# Altium project F1C200S.PrjPcb
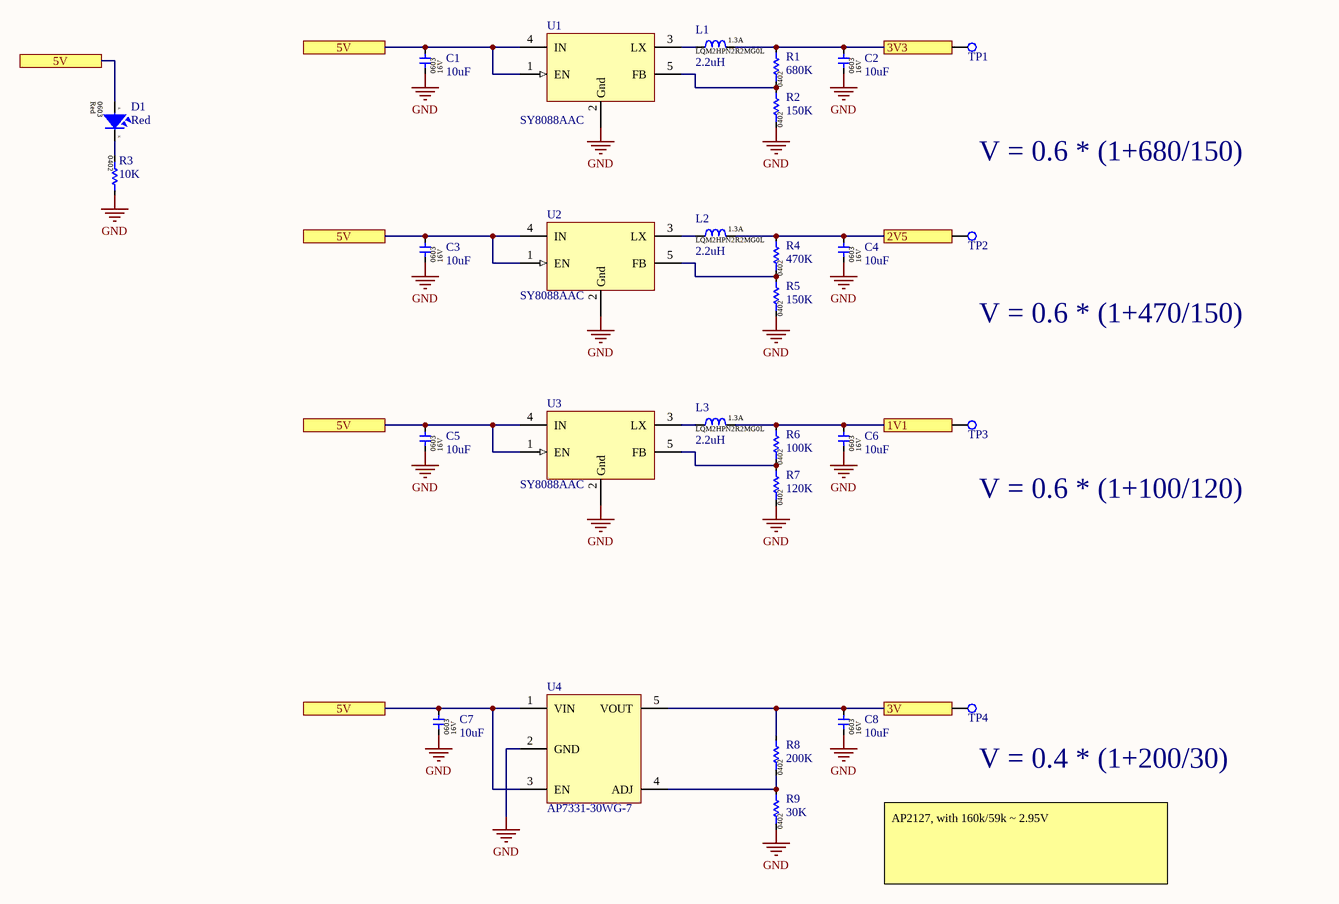
[diagram p0: POwer.SchDoc]
6 sheets, 131 parts. Net scope: flat (ports and power ports of the same name join across sheets).
Board file: PCB.PcbDoc
Sheets:
  POwer.SchDoc
  CPU.SchDoc
  LCD.SchDoc
  Memory.SchDoc
  Audio.SchDoc
  Misc.SchDoc

## Sheet POwer.SchDoc
size A3; SheetNumber: 1; SheetTotal: 6

### Parts
C1  10uF  [CAP-0603]
C2  10uF  [CAP-0603]
C3  10uF  [CAP-0603]
C4  10uF  [CAP-0603]
C5  10uF  [CAP-0603]
C6  10uF  [CAP-0603]
C7  10uF  [CAP-0603]
C8  10uF  [CAP-0603]
D1  Red  [LED-0603 RED]
L1  2.2uH  [IND-1008]
L2  2.2uH  [IND-1008]
L3  2.2uH  [IND-1008]
R1  680K  [RES-0402]
R2  150K  [RES-0402]
R3  10K  [RES-0402]
R4  470K  [RES-0402]
R5  150K  [RES-0402]
R6  100K  [RES-0402]
R7  120K  [RES-0402]
R8  200K  [RES-0402]
R9  30K  [RES-0402]
TP1  N/A  [Test point]  (value not drawn)  (no BOM)
TP2  N/A  [Test point]  (value not drawn)  (no BOM)
TP3  N/A  [Test point]  (value not drawn)  (no BOM)
TP4  N/A  [Test point]  (value not drawn)  (no BOM)
U1  SY8088AAC  [SOT23-5]
U2  SY8088AAC  [SOT23-5]
U3  SY8088AAC  [SOT23-5]
U4  AP7331-30WG-7  [SOT23-5]

### Ports
1V1, 2V5, 3V, 3V3, 5V

### Nets
AVCC: C8.2 R8.2 TP4.1 U4.5(VOUT) ; port 3V
GND: C1.1 C2.1 C3.1 C4.1 C5.1 C6.1 C7.1 C8.1 R2.1 R3.2 R5.1 R7.1 R9.1 U1.2(Gnd) U2.2(Gnd) U3.2(Gnd) U4.2(GND)
UVCC: C2.2 L1.2 R1.2 TP1.1 ; port 3V3
V-BACKLIGHT: C1.2 C3.2 C5.2 C7.2 D1.2(Anode) U1.1(EN) U1.4(IN) U2.1(EN) U2.4(IN) U3.1(EN) U3.4(IN) U4.1(VIN) U4.3(EN) ; port 5V
VCC-DRAM: C4.2 L2.2 R4.2 TP2.1 ; port 2V5
VDD-CORE: C6.2 L3.2 R6.2 TP3.1 ; port 1V1
NetD1_1: D1.1(Cathode) R3.1
NetL1_1: L1.1 U1.3(LX)
NetL2_1: L2.1 U2.3(LX)
NetL3_1: L3.1 U3.3(LX)
NetR1_1: R1.1 R2.2 U1.5(FB)
NetR4_1: R4.1 R5.2 U2.5(FB)
NetR6_1: R6.1 R7.2 U3.5(FB)
NetR8_1: R8.1 R9.2 U4.4(ADJ)

### Notes on the sheet
- V = 0.6 * (1+680/150)
- V = 0.6 * (1+470/150)
- (near TP3) V = 0.6 * (1+100/120)
- (near TP4) V = 0.4 * (1+200/30)
- AP2127, with 160k/59k ~ 2.95V
- (in symbol 19-217/R6C-AL1M2VY/3T) A; K

### Library data of the parts
C1-C8 = 0603X106M160CT: 16V 10uF X5R ±20% 0603 Multilayer Ceramic Capacitors MLCC - SMD/SMT ROHS; Manufacture: WALSIN; Package / Case: 0402; Component type: Capacitor; Manufacture part: 0603X106M160CT; Capacitor value: 10uF; Voltage: 16V; Package: 0603
D1 = 19-217/R6C-AL1M2VY/3T: Red 617.5~633.5nm 0603 Light Emitting Diodes (LED) RoHS; Manufacture: Everlight Elec; Package / Case: 0402; Component type: Led; Part reference: *; Manufacture part: 19-217/R6C-AL1M2VY/3T; Color: Red; Package: 0603
L1-L3 = LQM2HPN2R2MG0L: Inductor 1008, 2.2±20%, 1.3A; Manufacture: Murata Electronics; DCR: 0.1 Ω; Manufacture part: LQM2HPN2R2MG0L; Inductance value: 2.2uH; Irms max: 1.3A; Package: 1008
R1 = WR04X6803FTL: ±1% 1/16W 50V ±100ppm/℃ -55℃~+155℃ 680kΩ 0402 Chip Resistor - Surface Mount ROHS; Manufacture: WALSIN; Package / Case: 0201; Component type: Resistor; Manufacture part: WR04X6803FTL; Resistor value: 680K; Package: 0402
R2 R5 = WR04X1503FTL: 150kΩ ±1% 1/16W ±100ppm/℃ 0402 Chip Resistor - Surface Mount RoHS; Manufacture: WALSIN; Package / Case: 0201; Component type: Resistor; Manufacture part: WR04X1503FTL; Resistor value: 150K; Package: 0402
R3 = WR04X1002FTL: 10kΩ ±1% 1/16W ±100ppm/℃ 0402 Chip Resistor - Surface Mount RoHS; Manufacture: WALSIN; Package / Case: 0201; Component type: Resistor; Manufacture part: WR04X1002FTL; Resistor value: 10K; Package: 0402
R4 = WR04X4703FTL: ±1% 1/16W 50V ±100ppm/℃ -55℃~+155℃ 470kΩ 0402 Chip Resistor - Surface Mount ROHS; Manufacture: WALSIN; Package / Case: 0201; Component type: Resistor; Manufacture part: WR04X4703FTL; Resistor value: 470K; Package: 0402
R6 = WR04X1003FTL: 100kΩ ±1% 1/16W ±100ppm/℃ 0402 Chip Resistor - Surface Mount RoHS; Manufacture: WALSIN; Package / Case: 0201; Component type: Resistor; Manufacture part: WR04X1003FTL; Resistor value: 100K; Package: 0402
R7 = WR04X1203FTL: 120kΩ ±1% 1/16W ±100ppm/℃ 0402 Chip Resistor - Surface Mount RoHS; Manufacture: WALSIN; Package / Case: 0201; Component type: Resistor; Manufacture part: WR04X1203FTL; Resistor value: 120K; Package: 0402
R8 = WR04X2003FTL: 200kΩ ±1% 1/16W ±100ppm/℃ 0402 Chip Resistor - Surface Mount RoHS; Manufacture: WALSIN; Package / Case: 0201; Component type: Resistor; Manufacture part: WR04X2003FTL; Resistor value: 200K; Package: 0402
R9 = WR04X3002FTL: ±1% 1/16W ±100ppm/℃ 30kΩ 0402 Chip Resistor - Surface Mount ROHS; Manufacture: WALSIN; Package / Case: 0201; Component type: Resistor; Manufacture part: WR04X3002FTL; Resistor value: 30K; Package: 0402
TP1-TP4 = N/A: A point used for measure.; Manufacture part: N/A; Manufacture: N/A; Type: Test point
U1-U3 = SY8088AAC: 5.5V 1A SOT-23-5 DC-DC Converters RoHS; Manufacture: Richtek Tech; Manufacture part: SY8088AAC; Type: Buck; Package: SOT23-5; Datasheet: https://datasheet.lcsc.com/lcsc/Silergy-Corp-SY8088AAC_C79313.pdf
U4 = AP7331-30WG-7: Fixed 6V 3V 550mV @ 300mA SOT-25 Dropout Regulators(LDO) RoHS; Manufacture: Diodes Incorporated; Part number: AP7331-WG-7; Manufacture part: AP7331-30WG-7; Type: LDO; Package: SOT23-5; Datasheet: https://datasheet.lcsc.com/lcsc/Diodes-Incorporated-AP7331-WG-7_C212322.pdf

## Sheet CPU.SchDoc
size A3; SheetNumber: 3; SheetTotal: 7
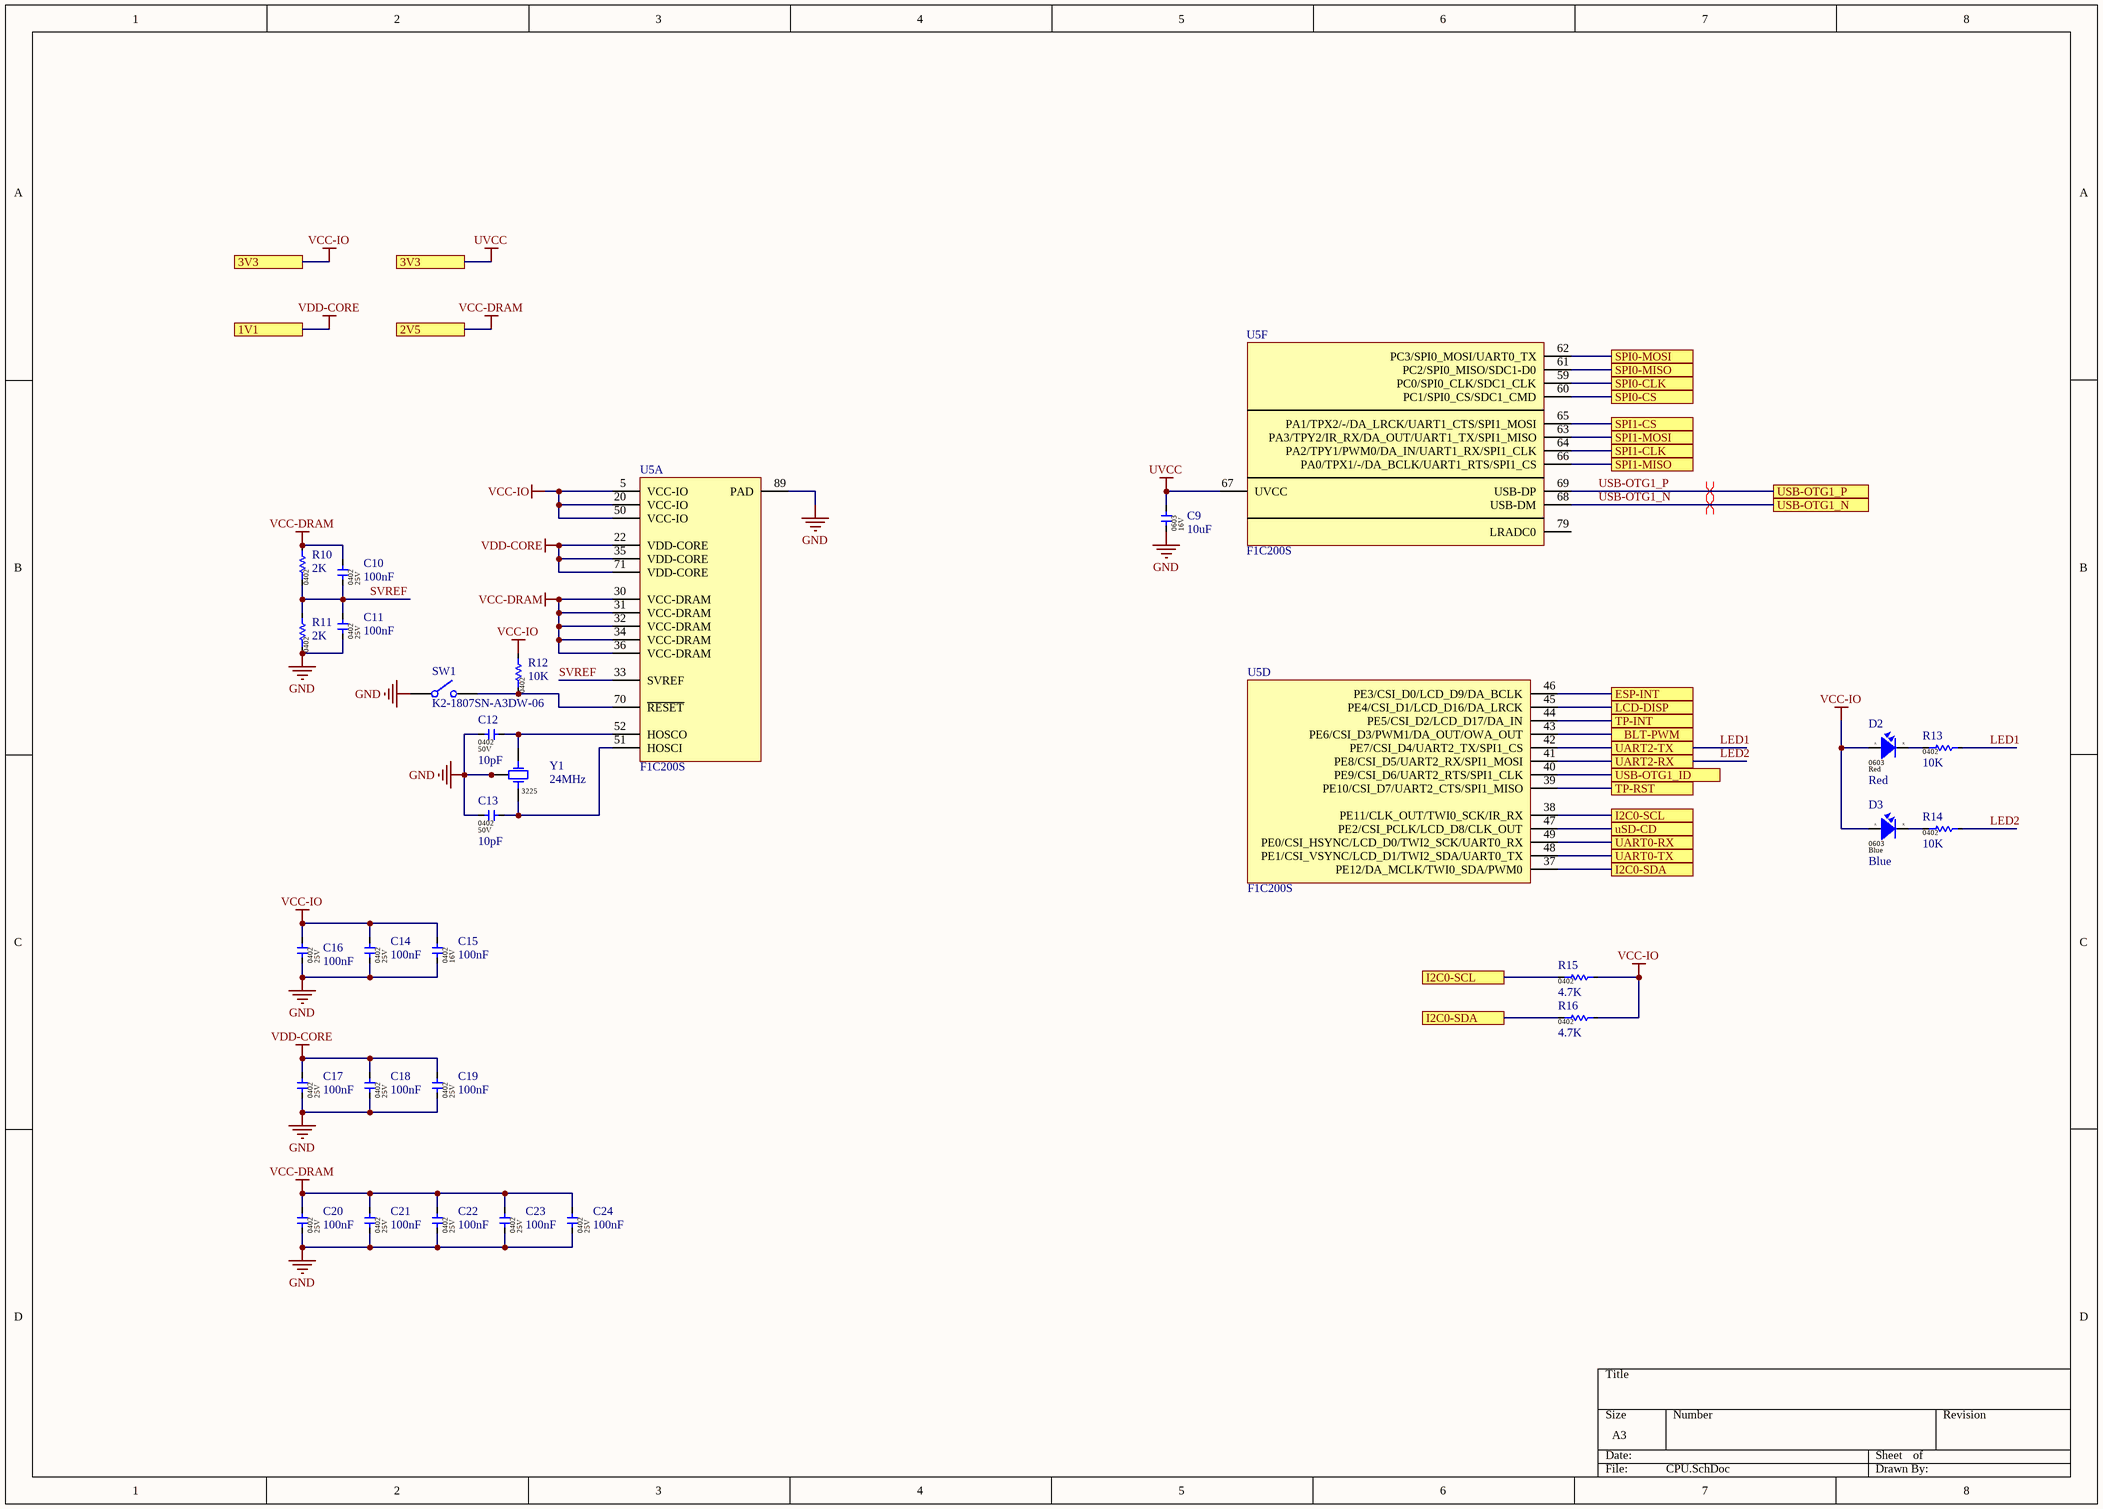
[diagram p1: CPU.SchDoc]

### Parts
C9  10uF  [CAP-0603]
C10  100nF  [CAP-0402]
C11  100nF  [CAP-0402]
C12  10pF  [CAP-0402]
C13  10pF  [CAP-0402]
C14  100nF  [CAP-0402]
C15  100nF  [CAP-0402]
C16  100nF  [CAP-0402]
C17  100nF  [CAP-0402]
C18  100nF  [CAP-0402]
C19  100nF  [CAP-0402]
C20  100nF  [CAP-0402]
C21  100nF  [CAP-0402]
C22  100nF  [CAP-0402]
C23  100nF  [CAP-0402]
C24  100nF  [CAP-0402]
D2  Red  [LED-0603 RED]
D3  Blue  [LED-0603 BLUE]
R10  2K  [RES-0402]
R11  2K  [RES-0402]
R12  10K  [RES-0402]
R13  10K  [RES-0402]
R14  10K  [RES-0402]
R15  4.7K  [RES-0402]
R16  4.7K  [RES-0402]
SW1  K2-1807SN-A3DW-06  [SW - TYPE 3]
U5  F1C200S  [F1Cx00s]  (parts A,D,F of 6)
Y1  24MHz  [Crystal-3225]

### Ports
1V1, 2V5, 3V3, BLT-PWM, ESP-INT, I2C0-SCL, I2C0-SDA, LCD-DISP, SPI0-CLK, SPI0-CS, SPI0-MISO, SPI0-MOSI, SPI1-CLK, SPI1-CS, SPI1-MISO, SPI1-MOSI, TP-INT, TP-RST, UART0-RX, UART0-TX, UART2-RX, UART2-TX, USB-OTG1_ID, USB-OTG1_N, USB-OTG1_P, uSD-CD

### Nets
GND: C9.1 C11.1 C12.1 C13.1 C14.1 C15.1 C16.1 C17.1 C18.1 C19.1 C20.1 C21.1 C22.1 C23.1 C24.1 R11.1 SW1.1 U5.89(PAD) Y1.2(GND) Y1.4(GND)
UVCC: C9.2 C14.2 C15.2 C16.2 D2.2(Anode) D3.2(Anode) R12.2 R15.2 R16.2 U5.5(VCC-IO) U5.20(VCC-IO) U5.50(VCC-IO) U5.67(UVCC) ; port 3V3  [also labelled VCC-IO]
VCC-DRAM: C10.2 C20.2 C21.2 C22.2 C23.2 C24.2 R10.2 U5.30(VCC-DRAM) U5.31(VCC-DRAM) U5.32(VCC-DRAM) U5.34(VCC-DRAM) U5.36(VCC-DRAM) ; port 2V5
VDD-CORE: C17.2 C18.2 C19.2 U5.22(VDD-CORE) U5.35(VDD-CORE) U5.71(VDD-CORE) ; port 1V1
LED1: R13.2 U5.42(PE7/CSI_D4/UART2_TX/SPI1_CS) ; port UART2-TX
LED2: R14.2 U5.41(PE8/CSI_D5/UART2_RX/SPI1_MOSI) ; port UART2-RX
SS-SCL: R15.1 U5.38(PE11/CLK_OUT/TWI0_SCK/IR_RX) ; port I2C0-SCL
SS-SDA: R16.1 U5.37(PE12/DA_MCLK/TWI0_SDA/PWM0) ; port I2C0-SDA
SVREF: C10.1 C11.2 R10.1 R11.2 U5.33(SVREF)
USB-OTG1_N: U5.68(USB-DM) ; port USB-OTG1_N
USB-OTG1_P: U5.69(USB-DP) ; port USB-OTG1_P
NetC12_2: C12.2 U5.52(HOSCO) Y1.1(X1)
NetC13_2: C13.2 U5.51(HOSCI) Y1.3(X2)
NetD2_1: D2.1(Cathode) R13.1
NetD3_1: D3.1(Cathode) R14.1
NetD5_2: U5.43(PE6/CSI_D3/PWM1/DA_OUT/OWA_OUT) ; port BLT-PWM
NetD6_5: U5.40(PE9/CSI_D6/UART2_RTS/SPI1_CLK) ; port USB-OTG1_ID
NetJ1_1: U5.39(PE10/CSI_D7/UART2_CTS/SPI1_MISO) ; port TP-RST
NetJ1_4: U5.44(PE5/CSI_D2/LCD_D17/DA_IN) ; port TP-INT
NetJ2_31: U5.45(PE4/CSI_D1/LCD_D16/DA_LRCK) ; port LCD-DISP
NetJ6_1: U5.48(PE1/CSI_VSYNC/LCD_D1/TWI2_SDA/UART0_TX) ; port UART0-TX
NetJ6_2: U5.49(PE0/CSI_HSYNC/LCD_D0/TWI2_SCK/UART0_RX) ; port UART0-RX
NetR12_1: R12.1 SW1.2 U5.70(~{RESET})
NetR24_1: U5.47(PE2/CSI_PCLK/LCD_D8/CLK_OUT) ; port uSD-CD
NetR27_2: U5.60(PC1/SPI0_CS/SDC1_CMD) ; port SPI0-CS
NetR30_1: U5.65(PA1/TPX2/-/DA_LRCK/UART1_CTS/SPI1_MOSI) ; port SPI1-CS
NetSW2_2: U5.59(PC0/SPI0_CLK/SDC1_CLK) ; port SPI0-CLK
NetU5_46: U5.46(PE3/CSI_D0/LCD_D9/DA_BCLK) ; port ESP-INT
NetU5_61: U5.61(PC2/SPI0_MISO/SDC1-D0) ; port SPI0-MISO
NetU5_62: U5.62(PC3/SPI0_MOSI/UART0_TX) ; port SPI0-MOSI
NetU5_63: U5.63(PA3/TPY2/IR_RX/DA_OUT/UART1_TX/SPI1_MISO) ; port SPI1-MOSI
NetU5_64: U5.64(PA2/TPY1/PWM0/DA_IN/UART1_RX/SPI1_CLK) ; port SPI1-CLK
NetU5_66: U5.66(PA0/TPX1/-/DA_BCLK/UART1_RTS/SPI1_CS) ; port SPI1-MISO

Not connected (* = marked no-connect by the designer): U5 79(LRADC0)

### Layout directives
differential pair; differential pair class DIFF90_USB: USB-OTG1_N, USB-OTG1_P

### Notes on the sheet
- (in symbol 19-217/BHC-ZL1M2RY/3T) A; K
- (in symbol 19-217/R6C-AL1M2VY/3T) A; K

### Library data of the parts
C9 = 0603X106M160CT: as C1 on sheet POwer; Package / Case: 0402; Component type: Capacitor; Manufacture part: 0603X106M160CT; Capacitor value: 10uF; Voltage: 16V; Package: 0603
C10 C11 C14 C16-C24 = 0402X104K250CT: 100nF ±10% 25V X5R 0402 Multilayer Ceramic Capacitors MLCC - SMD/SMT RoHS; Manufacture: WALSIN; Package / Case: 0402; Component type: Capacitor; Manufacture part: 0402X104K250CT; Capacitor value: 100nF; Voltage: 25V; Package: 0402
C12 C13 = 0402N100J500CT: 10pF ±5% 50V NP0 0402 Multilayer Ceramic Capacitors MLCC - SMD/SMT RoHS; Manufacture: WALSIN; Package / Case: 0402; Component type: Capacitor; Manufacture part: 0402N100J500CT; Capacitor value: 10pF; Voltage: 50V; Package: 0402
C15 = 0402B104K160CT: 100nF ±10% 16V X7R 0402 Multilayer Ceramic Capacitors MLCC - SMD/SMT RoHS; Manufacture: WALSIN; Package / Case: 0402; Component type: Capacitor; Manufacture part: 0402B104K160CT; Capacitor value: 100nF; Voltage: 16V; Package: 0402
D2 = 19-217/R6C-AL1M2VY/3T: as D1 on sheet POwer; Package / Case: 0402; Component type: Led; Part reference: *; Manufacture part: 19-217/R6C-AL1M2VY/3T; Color: Red; Package: 0603
D3 = 19-217/BHC-ZL1M2RY/3T: Blue 465~475nm 0603 Light Emitting Diodes (LED) RoHS; Manufacture: Everlight Elec; Package / Case: 0402; Component type: Led; Part reference: *; Manufacture part: 19-217/BHC-ZL1M2RY/3T; Color: Blue; Package: 0603
R10 R11 = WR04X2001FTL: 2kΩ ±1% 1/16W ±100ppm/℃ 0402 Chip Resistor - Surface Mount RoHS; Manufacture: WALSIN; Package / Case: 0201; Component type: Resistor; Manufacture part: WR04X2001FTL; Resistor value: 2K; Package: 0402
R12-R14 = WR04X1002FTL: as R3 on sheet POwer; Package / Case: 0201; Component type: Resistor; Manufacture part: WR04X1002FTL; Resistor value: 10K; Package: 0402
R15 R16 = WR04X4701FTL: 4.7kΩ ±1% 1/16W ±100ppm/℃ 0402 Chip Resistor - Surface Mount RoHS; Manufacture: WALSIN; Package / Case: 0201; Component type: Resistor; Manufacture part: WR04X4701FTL; Resistor value: 4.7K; Package: 0402
SW1 = K2-1807SN-A3DW-06: SMD,3×4×2.0mm Tactile Switches RoHS; Manufacture: Korean Hroparts Elec; Manufacture part: K2-1807SN-A3DW-06; Type: Tactile Switches; Datasheet: https://datasheet.lcsc.com/lcsc/2008221234_XUNPU-TS-1088-AR02016_C720477.pdf
U5 = F1C200S: The Allwinner F1C200s is a small SoC with an ARM926EJ-S CPU core and 64MB of embedded DDR SDRAM.; Manufacture part: F1C200S; Manufacture: Allwinner; Package: QFN-88 (10x10); Datasheet: https://linux-sunxi.org/images/1/11/Allwinner_F1C200s_Datasheet_V1.0.pdf
Y1 = SX32Y024000BC1T: 24MHz ±10ppm 12pF 40Ω SMD-3225 Crystals RoHS; Manufacture: TKD; Manufacture part: SX32Y024000BC1T; Crystal value: 24MHz; Package: 3225

## Sheet LCD.SchDoc
size A3; SheetNumber: 4; SheetTotal: 7
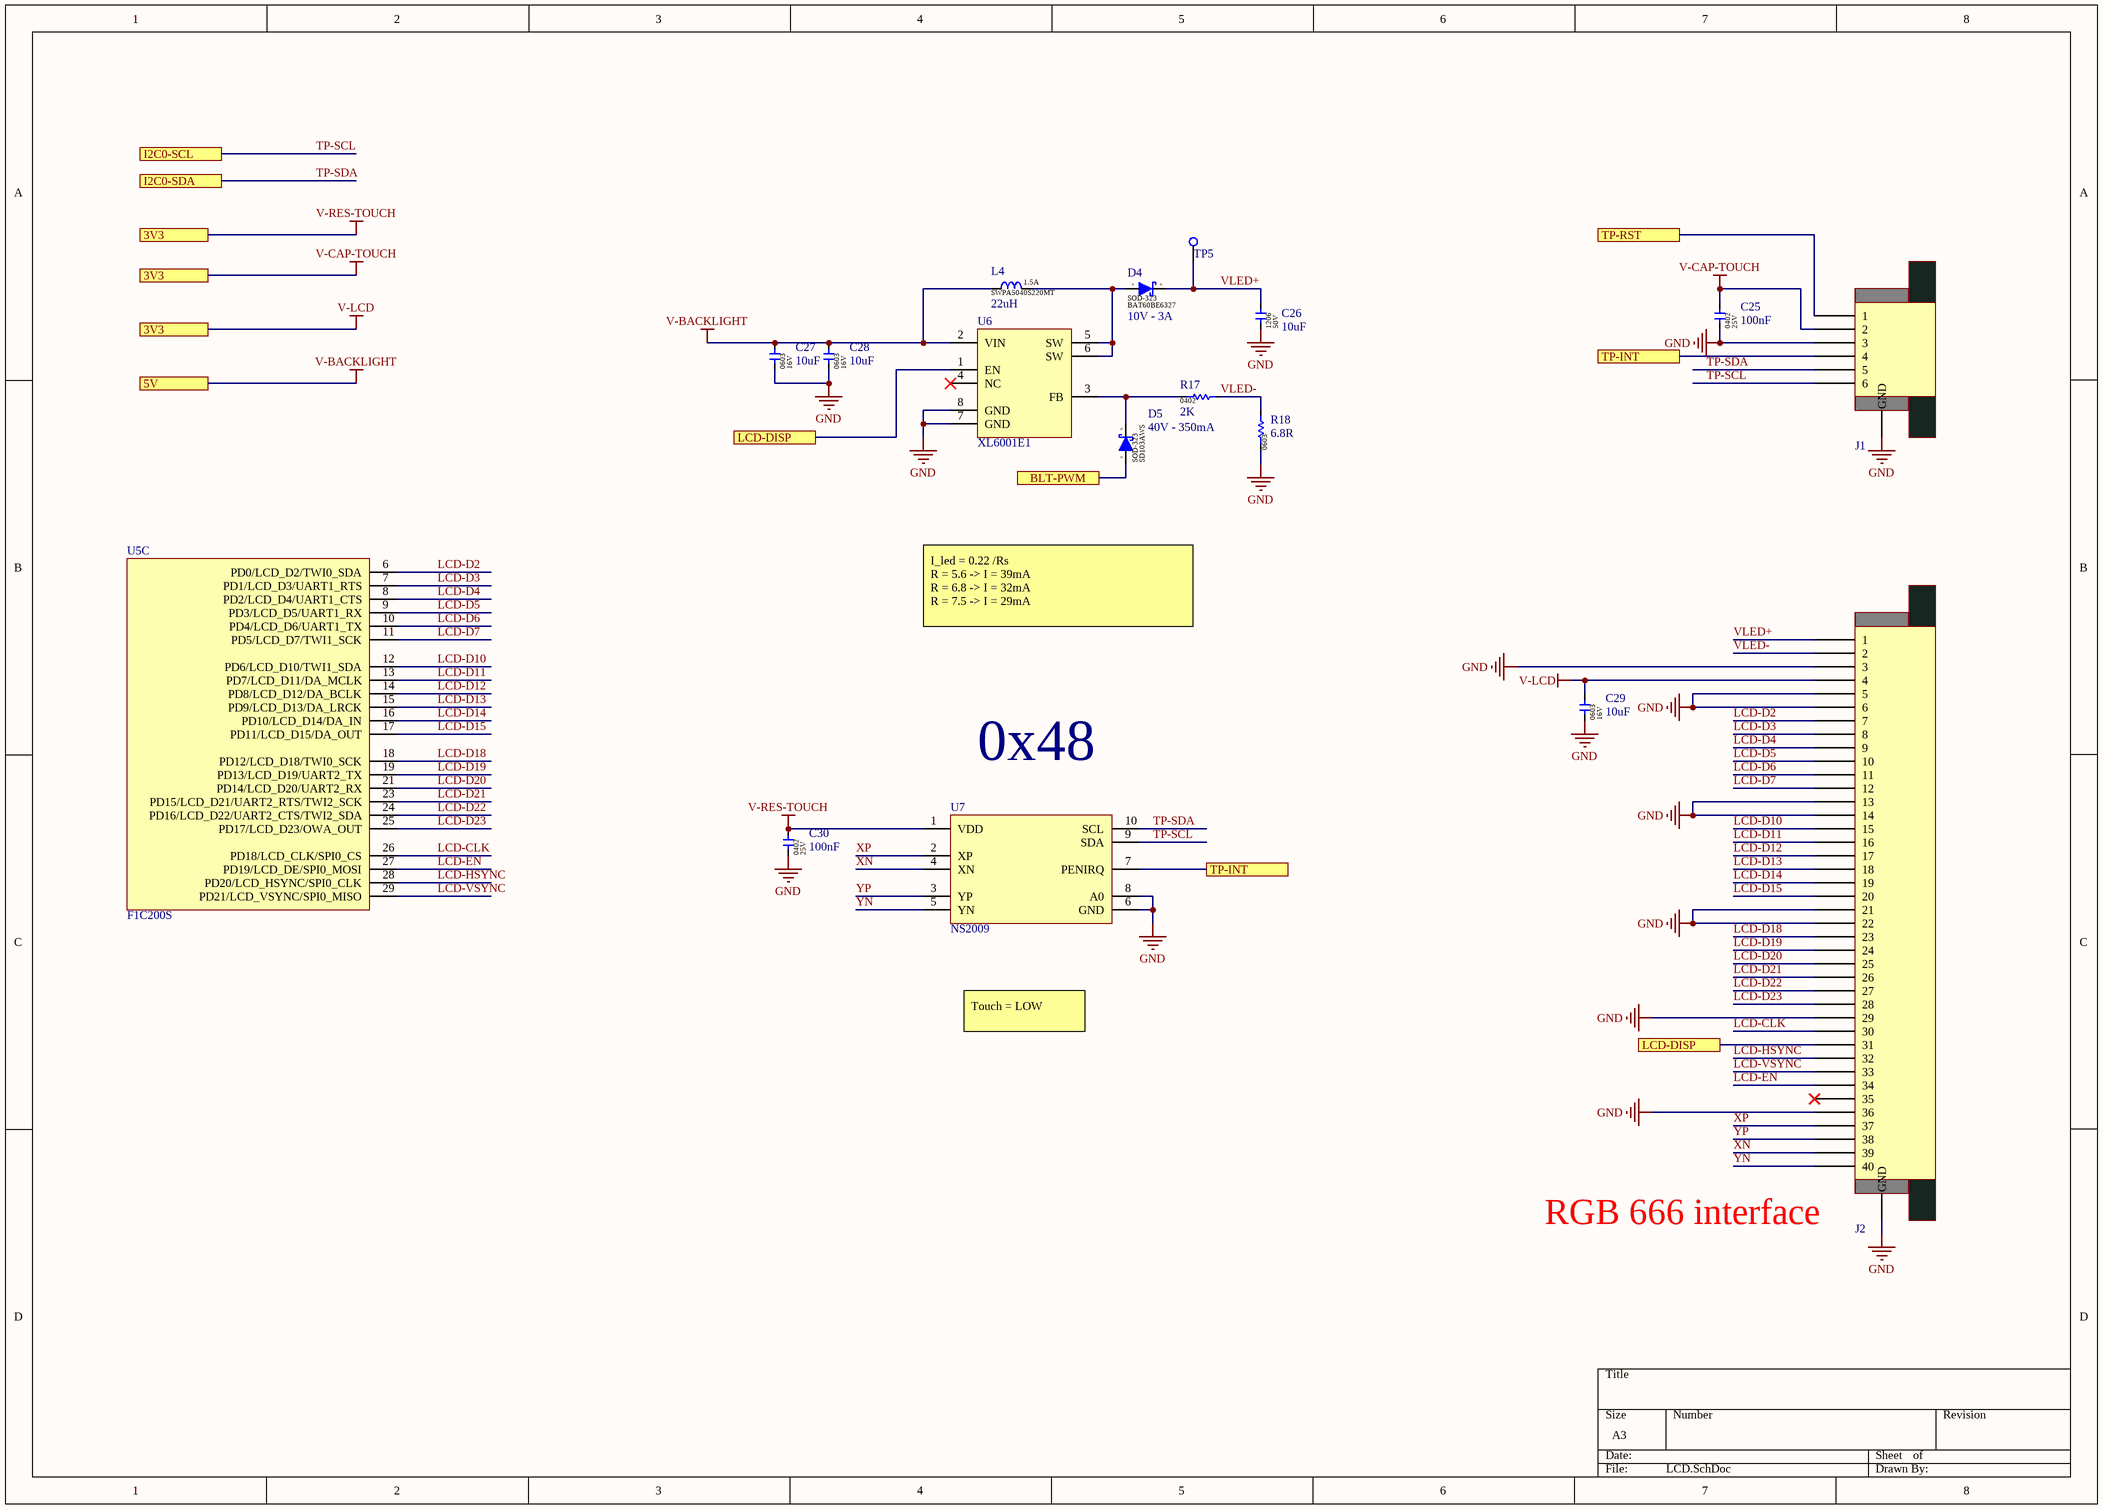
[diagram p2: LCD.SchDoc]

### Parts
C25  100nF  [CAP-0402]
C26  10uF  [CAP-1206]
C27  10uF  [CAP-0603]
C28  10uF  [CAP-0603]
C29  10uF  [CAP-0603]
C30  100nF  [CAP-0402]
D4  10V - 3A  [SOD323 (UNI)]
D5  40V - 350mA  [SOD323 (UNI)]
J1  AFC07-S06ECC-00  [FPC - 6P, 0.5mm, top]  (value not drawn)
J2  AFC07-S40ECC-00  [FPC - 40P, 0.5mm, top]  (value not drawn)
L4  22uH  [IND-5040]
R17  2K  [RES-0402]
R18  6.8R  [RES-0603]
TP5  N/A  [Test point]  (value not drawn)  (no BOM)
U5  F1C200S  [F1Cx00s]  (part C of 6)
U6  XL6001E1  [SOP-8]
U7  NS2009  [MSOP-10]

### Ports
3V3, 5V, BLT-PWM, I2C0-SCL, I2C0-SDA, LCD-DISP, TP-INT, TP-RST

### Nets
GND: C25.1 C26.1 C27.1 C28.1 C29.1 C30.1 J1.0(GND) J1.3 J2.0(GND) J2.3 J2.5 J2.6 J2.13 J2.14 J2.21 J2.22 J2.29 J2.36 R18.1 U6.7(GND) U6.8(GND) U7.6(GND) U7.8(A0)
V-BACKLIGHT: C27.2 C28.2 L4.1 U6.2(VIN) ; port 5V
V-CAP-TOUCH: C25.2 C29.2 C30.2 J1.2 J2.4 U7.1(VDD) ; port 3V3  [also labelled V-LCD, V-RES-TOUCH]  [project net UVCC]
LCD-CLK: J2.30 U5.26(PD18/LCD_CLK/SPI0_CS)
LCD-D2: J2.7 U5.6(PD0/LCD_D2/TWI0_SDA)
LCD-D3: J2.8 U5.7(PD1/LCD_D3/UART1_RTS)
LCD-D4: J2.9 U5.8(PD2/LCD_D4/UART1_CTS)
LCD-D5: J2.10 U5.9(PD3/LCD_D5/UART1_RX)
LCD-D6: J2.11 U5.10(PD4/LCD_D6/UART1_TX)
LCD-D7: J2.12 U5.11(PD5/LCD_D7/TWI1_SCK)
LCD-D10: J2.15 U5.12(PD6/LCD_D10/TWI1_SDA)
LCD-D11: J2.16 U5.13(PD7/LCD_D11/DA_MCLK)
LCD-D12: J2.17 U5.14(PD8/LCD_D12/DA_BCLK)
LCD-D13: J2.18 U5.15(PD9/LCD_D13/DA_LRCK)
LCD-D14: J2.19 U5.16(PD10/LCD_D14/DA_IN)
LCD-D15: J2.20 U5.17(PD11/LCD_D15/DA_OUT)
LCD-D18: J2.23 U5.18(PD12/LCD_D18/TWI0_SCK)
LCD-D19: J2.24 U5.19(PD13/LCD_D19/UART2_TX)
LCD-D20: J2.25 U5.21(PD14/LCD_D20/UART2_RX)
LCD-D21: J2.26 U5.23(PD15/LCD_D21/UART2_RTS/TWI2_SCK)
LCD-D22: J2.27 U5.24(PD16/LCD_D22/UART2_CTS/TWI2_SDA)
LCD-D23: J2.28 U5.25(PD17/LCD_D23/OWA_OUT)
LCD-EN: J2.34 U5.27(PD19/LCD_DE/SPI0_MOSI)
LCD-HSYNC: J2.32 U5.28(PD20/LCD_HSYNC/SPI0_CLK)
LCD-VSYNC: J2.33 U5.29(PD21/LCD_VSYNC/SPI0_MISO)
TP-SCL: J1.6 U7.9(SDA) ; port I2C0-SCL  [project net SS-SCL]
TP-SDA: J1.5 U7.10(SCL) ; port I2C0-SDA  [project net SS-SDA]
VLED+: C26.2 D4.1(Cathode) J2.1 TP5.1
VLED-: J2.2 R17.2 R18.2
XN: J2.39 U7.4(XN)
XP: J2.37 U7.2(XP)
YN: J2.40 U7.5(YN)
YP: J2.38 U7.3(YP)
NetD4_2: D4.2(Anode) L4.2 U6.5(SW) U6.6(SW)
NetD5_1: D5.1(Cathode) R17.1 U6.3(FB)
NetD5_2: D5.2(Anode) ; port BLT-PWM
NetJ1_1: J1.1 ; port TP-RST
NetJ1_4: J1.4 U7.7(PENIRQ) ; port TP-INT
NetJ2_31: J2.31 U6.1(EN) ; port LCD-DISP

Not connected (* = marked no-connect by the designer): J2 35*; U6 4(NC)*

### Notes on the sheet
- I_led = 0.22 /Rs
  R = 5.6 -> I = 39mA
  R = 6.8 -> I = 32mA
  R = 7.5 -> I = 29mA
- 0x48
- Touch = LOW
- (near J2) RGB 666 interface
- (in symbol BAT60BE6327) A; K
- (in symbol SD103AWS) K; A

### Library data of the parts
C25 C30 = 0402X104K250CT: as C10 on sheet CPU; Package / Case: 0402; Component type: Capacitor; Manufacture part: 0402X104K250CT; Capacitor value: 100nF; Voltage: 25V; Package: 0402
C26 = 1206X106K500CT: 10uF ±10% 50V X5R 1206 Multilayer Ceramic Capacitors MLCC - SMD/SMT RoHS; Manufacture: WALSIN; Package / Case: 0402; Component type: Capacitor; Manufacture part: 1206X106K500CT; Capacitor value: 10uF; Voltage: 50V; Package: 1206
C27-C29 = 0603X106M160CT: as C1 on sheet POwer; Package / Case: 0402; Component type: Capacitor; Manufacture part: 0603X106M160CT; Capacitor value: 10uF; Voltage: 16V; Package: 0603
D4 = BAT60BE6327: 10V 3A 600mV @ 1A SOD-323 Schottky Barrier Diodes (SBD) RoHS; Manufacture: Infineon Technologies; Manufacture part: BAT60BE6327; Type: Schottky diode; Diode value: 10V - 3A; Package: SOD-323; Datasheet: https://datasheet.lcsc.com/lcsc/1809021231_Infineon-Technologies-BAT60BE6327_C91059.pdf
D5 = SD103AWS: 40V 350mA 600mV @ 200mA SOD-323 Schottky Barrier Diodes (SBD) ROHS; Manufacture: Shikues; Manufacture part: SD103AWS; Type: Schottky diode; Diode value: 40V - 350mA; Package: SOD-323; Datasheet: https://datasheet.lcsc.com/lcsc/1809211226_Shikues-SD103AWS_C109204.pdf
J1 = AFC07-S06ECC-00: Slide Lock Contact,Top 6P FFC/FPC Connectors ROHS; Manufacture: JUSHUO; Manufacture part: AFC07-S06ECC-00; Type: FPC; Datasheet: https://datasheet.lcsc.com/lcsc/1811021327_JUSHUO-AFC07-S06ECC-00_C11083.pdf
J2 = AFC07-S40ECC-00: Contact,Top 40 0.020"（0.50mm） 0.079"（2.00mm） Slide Lock 40P FFC, FPC Connectors RoHS; Manufacture: JUSHUO; Manufacture part: AFC07-S40ECC-00; Type: FPC; Datasheet: https://datasheet.lcsc.com/lcsc/JUSHUO-AFC07-S40ECC-00_C11097.pdf
L4 = SWPA5040S220MT: Inductor 22uH ±20% 1.5A, 5.0x5.0x4; Manufacture: SUNLORD; DCR: 0.168 Ω; Manufacture part: SWPA5040S220MT; Inductance value: 22uH; Irms max: 1.5A; Package: 5040
R17 = WR04X2001FTL: as R10 on sheet CPU; Package / Case: 0201; Component type: Resistor; Manufacture part: WR04X2001FTL; Resistor value: 2K; Package: 0402
R18 = WR06W6R80FTL: 6.8Ω ±1% ±1% 0.1W -200ppm/℃~+400ppm/℃ 0603 Chip Resistor - Surface Mount RoHS; Manufacture: WALSIN; Package / Case: 0201; Component type: Resistor; Manufacture part: WR06W6R80FTL; Resistor value: 6.8R; Package: 0603
TP5 = N/A: A point used for measure.; Manufacture part: N/A; Manufacture: N/A; Type: Test point
U5 = F1C200S: as U5 on sheet CPU; Manufacture part: F1C200S; Manufacture: Allwinner; Package: QFN-88 (10x10); Datasheet: https://linux-sunxi.org/images/1/11/Allwinner_F1C200s_Datasheet_V1.0.pdf
U6 = XL6001E1: SOIC-8_150mil LED Drivers RoHS; Manufacture: XLSEMI; Manufacture part: XL6001E1; Package: SOP-8; Datasheet: https://datasheet.lcsc.com/lcsc/1809191820_XLSEMI-XL6001E1_C73343.pdf
U7 = NS2009: MSOP-10 Touch Screen Controllers RoHS; Manufacture: Shenzhen Nsiway Tech; Manufacture part: NS2009; Package: MSOP-10; Datasheet: https://datasheet.lcsc.com/lcsc/1810181630_Shenzhen-Nsiway-Tech-NS2009_C219024.pdf

## Sheet Memory.SchDoc
size A3; SheetNumber: 5; SheetTotal: 7
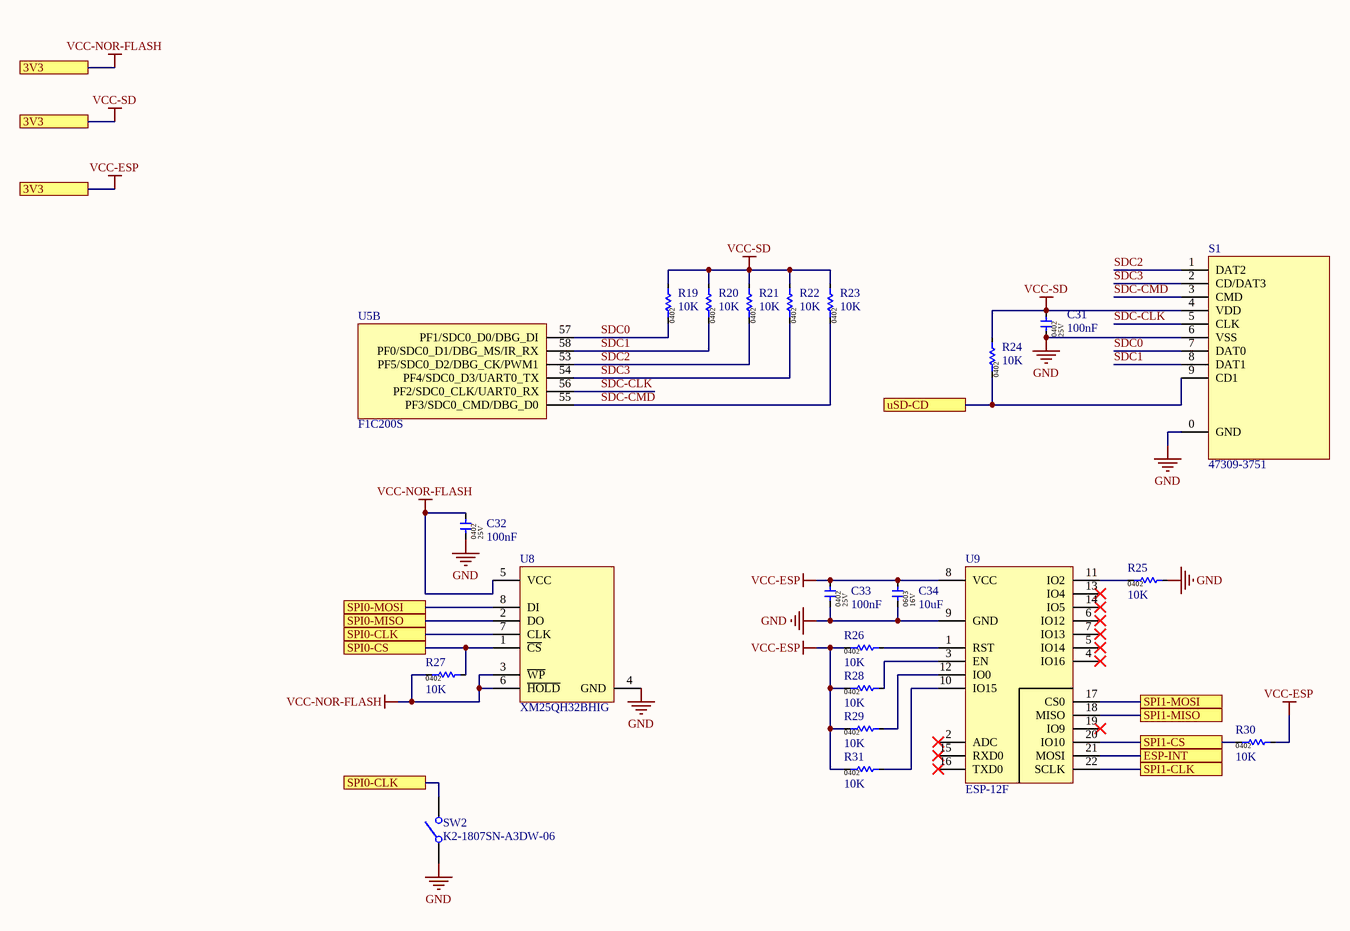
[diagram p3: Memory.SchDoc]

### Parts
C31  100nF  [CAP-0402]
C32  100nF  [CAP-0402]
C33  100nF  [CAP-0402]
C34  10uF  [CAP-0603]
R19  10K  [RES-0402]
R20  10K  [RES-0402]
R21  10K  [RES-0402]
R22  10K  [RES-0402]
R23  10K  [RES-0402]
R24  10K  [RES-0402]
R25  10K  [RES-0402]
R26  10K  [RES-0402]
R27  10K  [RES-0402]
R28  10K  [RES-0402]
R29  10K  [RES-0402]
R30  10K  [RES-0402]
R31  10K  [RES-0402]
S1  47309-3751  [Micro SDCARD short]
SW2  K2-1807SN-A3DW-06  [SW - TYPE 3]
U5  F1C200S  [F1Cx00s]  (part B of 6)
U8  XM25QH32BHIG  [SOP8-208mil]
U9  ESP-12F  [ESP8266]

### Ports
3V3, ESP-INT, SPI0-CLK, SPI0-CS, SPI0-MISO, SPI0-MOSI, SPI1-CLK, SPI1-CS, SPI1-MISO, SPI1-MOSI, uSD-CD

### Nets
GND: C31.1 C32.1 C33.1 C34.1 R25.2 S1.0(GND) S1.6(VSS) SW2.1 U8.4(GND) U9.9(GND)
VCC-ESP: C31.2 C32.2 C33.2 C34.2 R19.2 R20.2 R21.2 R22.2 R23.2 R24.2 R26.1 R27.1 R28.1 R29.1 R30.2 R31.1 S1.4(VDD) U8.3(~{WP}) U8.5(VCC) U8.6(~{HOLD}) U9.8(VCC) ; port 3V3  [also labelled VCC-NOR-FLASH, VCC-SD]  [project net UVCC]
SDC0: R19.1 S1.7(DAT0) U5.57(PF1/SDC0_D0/DBG_DI)
SDC1: R20.1 S1.8(DAT1) U5.58(PF0/SDC0_D1/DBG_MS/IR_RX)
SDC2: R21.1 S1.1(DAT2) U5.53(PF5/SDC0_D2/DBG_CK/PWM1)
SDC3: R22.1 S1.2(CD/DAT3) U5.54(PF4/SDC0_D3/UART0_TX)
SDC-CLK: S1.5(CLK) U5.56(PF2/SDC0_CLK/UART0_RX)
SDC-CMD: R23.1 S1.3(CMD) U5.55(PF3/SDC0_CMD/DBG_D0)
NetR24_1: R24.1 S1.9(CD1) ; port uSD-CD
NetR25_1: R25.1 U9.11(IO2)
NetR26_2: R26.2 U9.1(RST)
NetR27_2: R27.2 U8.1(~{CS}) ; port SPI0-CS
NetR28_2: R28.2 U9.3(EN)
NetR29_2: R29.2 U9.12(IO0)
NetR30_1: R30.1 U9.20(IO10) ; port SPI1-CS
NetR31_2: R31.2 U9.10(IO15)
NetSW2_2: SW2.2 U8.7(CLK) ; port SPI0-CLK
NetU5_46: U9.21(MOSI) ; port ESP-INT
NetU5_61: U8.2(DO) ; port SPI0-MISO
NetU5_62: U8.8(DI) ; port SPI0-MOSI
NetU5_63: U9.17(CS0) ; port SPI1-MOSI
NetU5_64: U9.22(SCLK) ; port SPI1-CLK
NetU5_66: U9.18(MISO) ; port SPI1-MISO

Not connected (* = marked no-connect by the designer): U9 2(ADC)* 4(IO16)* 5(IO14)* 6(IO12)* 7(IO13)* 13(IO4)* 14(IO5)* 15(RXD0)* 16(TXD0)* 19(IO9)*

### Library data of the parts
C31-C33 = 0402X104K250CT: as C10 on sheet CPU; Package / Case: 0402; Component type: Capacitor; Manufacture part: 0402X104K250CT; Capacitor value: 100nF; Voltage: 25V; Package: 0402
C34 = 0603X106M160CT: as C1 on sheet POwer; Package / Case: 0402; Component type: Capacitor; Manufacture part: 0603X106M160CT; Capacitor value: 10uF; Voltage: 16V; Package: 0603
R19-R31 = WR04X1002FTL: as R3 on sheet POwer; Package / Case: 0201; Component type: Resistor; Manufacture part: WR04X1002FTL; Resistor value: 10K; Package: 0402
S1 = 47309-3751: Short micro sd card 3.75H; Manufacture: MOLEX; Manufacture part: 47309-3751; Type: SDCARD; Datasheet: https://www.tme.eu/Document/aa8fcf3c31c1e1afb508cff41bf97167/473093751.pdf
SW2 = K2-1807SN-A3DW-06: as SW1 on sheet CPU; Manufacture part: K2-1807SN-A3DW-06; Type: Tactile Switches; Datasheet: https://datasheet.lcsc.com/lcsc/2008221234_XUNPU-TS-1088-AR02016_C720477.pdf
U5 = F1C200S: as U5 on sheet CPU; Manufacture part: F1C200S; Manufacture: Allwinner; Package: QFN-88 (10x10); Datasheet: https://linux-sunxi.org/images/1/11/Allwinner_F1C200s_Datasheet_V1.0.pdf
U8 = XM25QH32BHIG: 32Mb (256 Bytes x 16384 pages) SPI - Dual/Quad I/O, QPI FLASH Non-Volatile SOP-8L NOR FLASH ROHS; Manufacture: XMC; Manufacture part: XM25QH32BHIG; Package: SOP-8; Datasheet: https://datasheet.lcsc.com/lcsc/1811072025_XMC-XM25QH32BHIG_C328460.pdf
U9 = ESP-12F: ESP8266 module; Manufacture: Ai-Thinker; Manufacture part: ESP-12F; Package: N/A; Datasheet: https://docs.ai-thinker.com/_media/esp8266/docs/esp-12f_product_specification_en.pdf

## Sheet Audio.SchDoc
size A3; SheetNumber: 5; SheetTotal: 6
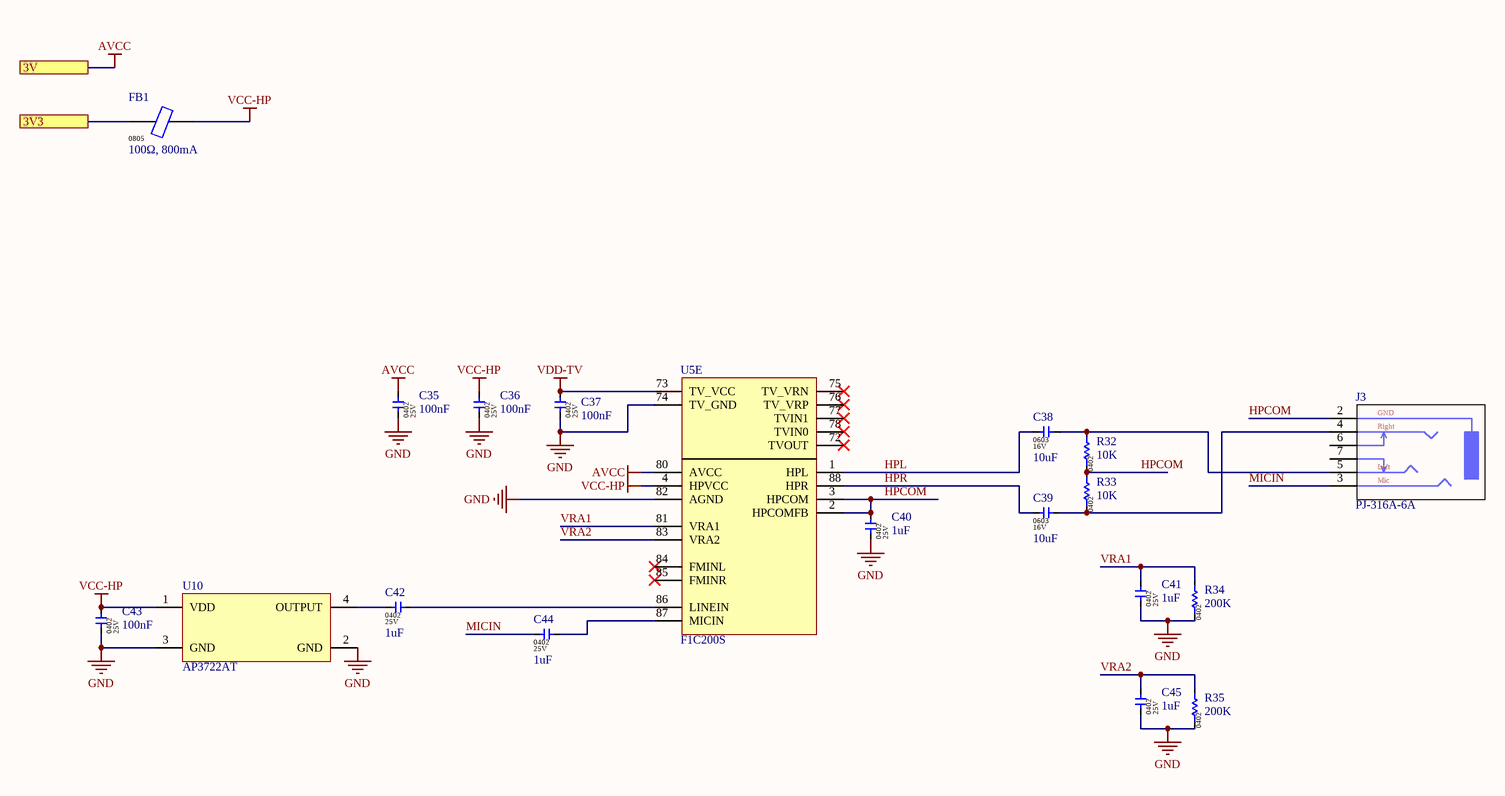
[diagram p4: Audio.SchDoc]

### Parts
C35  100nF  [CAP-0402]
C36  100nF  [CAP-0402]
C37  100nF  [CAP-0402]
C38  10uF  [CAP-0603]
C39  10uF  [CAP-0603]
C40  1uF  [CAP-0402]
C41  1uF  [CAP-0402]
C42  1uF  [CAP-0402]
C43  100nF  [CAP-0402]
C44  1uF  [CAP-0402]
C45  1uF  [CAP-0402]
FB1  100Ω, 800mA  [Ferrite-0805]
J3  PJ-316A-6A  [Audio 3.5mm, 6 pin]
R32  10K  [RES-0402]
R33  10K  [RES-0402]
R34  200K  [RES-0402]
R35  200K  [RES-0402]
U5  F1C200S  [F1Cx00s]  (part E of 6)
U10  AP3722AT  [AP3722AT]

### Ports
3V, 3V3

### Nets
AVCC: C35.2 U5.80(AVCC) ; port 3V
GND: C35.1 C36.1 C37.1 C40.1 C41.1 C43.1 C45.1 R34.1 R35.1 U5.74(TV_GND) U5.82(AGND) U10.2(GND) U10.3(GND)
UVCC: FB1.1 ; port 3V3
VCC-HP: C36.2 C43.2 FB1.2 U5.4(HPVCC) U10.1(VDD)
VDD-TV: C37.2 U5.73(TV_VCC)
HPCOM: C40.2 J3.2 R32.1 R33.2 U5.2(HPCOMFB) U5.3(HPCOM)
HPL: C38.1 U5.1(HPL)
HPR: C39.1 U5.88(HPR)
MICIN: C44.1 J3.3
VRA1: C41.2 R34.2 U5.81(VRA1)
VRA2: C45.2 R35.2 U5.83(VRA2)
NetC38_2: C38.2 J3.5 R32.2
NetC39_2: C39.2 J3.4 R33.1
NetC42_1: C42.1 U10.4(OUTPUT)
NetC42_2: C42.2 U5.86(LINEIN)
NetC44_2: C44.2 U5.87(MICIN)

Not connected (* = marked no-connect by the designer): J3 6 7; U5 72(TVOUT)* 75(TV_VRN)* 76(TV_VRP)* 77(TVIN1)* 78(TVIN0)* 84(FMINL)* 85(FMINR)*

### Notes on the sheet
- (in symbol PJ-316A-6A) GND; Right; Left; Mic

### Library data of the parts
C35-C37 C43 = 0402X104K250CT: as C10 on sheet CPU; Package / Case: 0402; Component type: Capacitor; Manufacture part: 0402X104K250CT; Capacitor value: 100nF; Voltage: 25V; Package: 0402
C38 C39 = 0603X106M160CT: as C1 on sheet POwer; Package / Case: 0402; Component type: Capacitor; Manufacture part: 0603X106M160CT; Capacitor value: 10uF; Voltage: 16V; Package: 0603
C40-C42 C44 C45 = 0402X105K250CT: 25V 1uF X5R ±10% 0402 Multilayer Ceramic Capacitors MLCC - SMD/SMT ROHS; Manufacture: WALSIN; Package / Case: 0402; Component type: Capacitor; Manufacture part: 0402X105K250CT; Capacitor value: 1uF; Voltage: 25V; Package: 0402
FB1 = GZ2012D101TF: 100Ω @ 100MHz 800mA 1 150mΩ 0805 Ferrite Beads RoHS; Manufacture: SUNLORD; Manufacture part: GZ2012D101TF; Package: 0805; Value: 100Ω, 800mA
J3 = PJ-316A-6A: 3.5mm SMD Headphone Holder 6 Female Horizontal SMD Audio & Video Connectors RoHS; Manufacture: Korean Hroparts Elec; Manufacture part: PJ-316A-6A; Type: Audio 3.5mm; Datasheet: https://datasheet.lcsc.com/lcsc/1810121710_Korean-Hroparts-Elec-PJ-316A-6A_C128987.pdf
R32 R33 = WR04X1002FTL: as R3 on sheet POwer; Package / Case: 0201; Component type: Resistor; Manufacture part: WR04X1002FTL; Resistor value: 10K; Package: 0402
R34 R35 = WR04X2003FTL: as R8 on sheet POwer; Package / Case: 0201; Component type: Resistor; Manufacture part: WR04X2003FTL; Resistor value: 200K; Package: 0402
U5 = F1C200S: as U5 on sheet CPU; Manufacture part: F1C200S; Manufacture: Allwinner; Package: QFN-88 (10x10); Datasheet: https://linux-sunxi.org/images/1/11/Allwinner_F1C200s_Datasheet_V1.0.pdf
U10 = AP3722AT: SMD,3.76x2.24x1.1mm MEMS Microphones ROHS; Manufacture: ALLPOWER(ShenZhen Quan Li Semiconductor); Manufacture part: AP3722AT; Package: N/A; Datasheet: https://datasheet.lcsc.com/lcsc/2011200934_ALLPOWER-ShenZhen-Quan-Li-Semiconductor-AP3722AT_C918198.pdf

## Sheet Misc.SchDoc
size A3; SheetNumber: 6; SheetTotal: 6
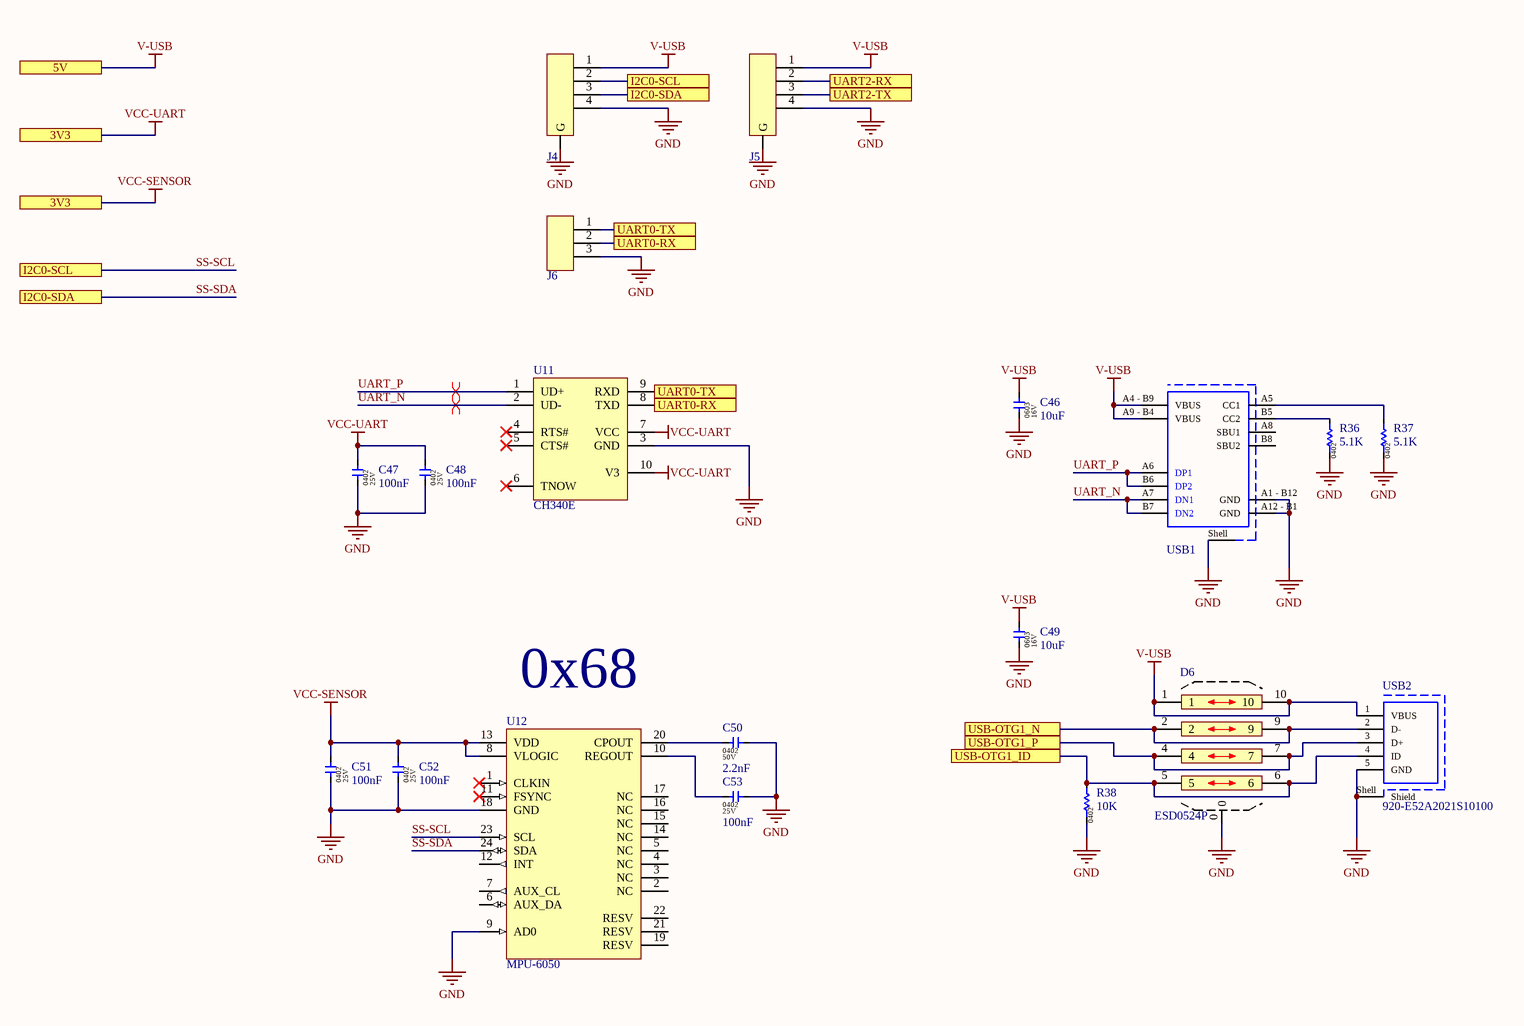
[diagram p5: Misc.SchDoc]

### Parts
C46  10uF  [CAP-0603]
C47  100nF  [CAP-0402]
C48  100nF  [CAP-0402]
C49  10uF  [CAP-0603]
C50  2.2nF  [CAP-0402]
C51  100nF  [CAP-0402]
C52  100nF  [CAP-0402]
C53  100nF  [CAP-0402]
D6  ESD0524P  [DFN2510]
J4  1.25T-4P-WT  [Conn MX1.25 (4)]  (value not drawn)
J5  1.25T-4P-WT  [Conn MX1.25 (4)]  (value not drawn)
J6  PZ254V-11-03P  [Conn 3P-2.54H]  (value not drawn)
R36  5.1K  [RES-0402]
R37  5.1K  [RES-0402]
R38  10K  [RES-0402]
U11  CH340E  [MSOP-10]
U12  MPU-6050  [QFN24-4x4MM_PAD]
USB1  918-418K2023S40001  [1 FEMALE USB -C 16]  (value not drawn)
USB2  920-E52A2021S10100  [Micro USB - type 2]

### Ports
3V3, 5V, I2C0-SCL, I2C0-SDA, UART0-RX, UART0-TX, UART2-RX, UART2-TX, USB-OTG1_ID, USB-OTG1_N, USB-OTG1_P

### Nets
GND: C46.1 C47.1 C48.1 C49.1 C50.2 C51.1 C52.1 C53.2 D6.0 J4.0(G) J4.4 J5.0(G) J5.4 J6.3 R36.1 R37.1 R38.1 U11.3(GND) U12.9(AD0) U12.18(GND) USB1.A1_-_B12(GND) USB1.A12_-_B1(GND) USB1.Shell(Shield) USB2.5(GND) USB2.Shell(Shield)
V-USB: C46.2 C49.2 D6.1 D6.10 J4.1 J5.1 USB1.A4_-_B9(VBUS) USB1.A9_-_B4(VBUS) USB2.1(VBUS) ; port 5V  [project net V-BACKLIGHT]
VCC-SENSOR: C47.2 C48.2 C51.2 C52.2 U11.7(VCC) U11.10(V3) U12.8(VLOGIC) U12.13(VDD) ; port 3V3  [also labelled VCC-UART]  [project net UVCC]
LED1: J5.3 ; port UART2-TX
LED2: J5.2 ; port UART2-RX
SS-SCL: J4.2 U12.23(SCL) ; port I2C0-SCL
SS-SDA: J4.3 U12.24(SDA) ; port I2C0-SDA
UART_N: U11.2(UD-) USB1.A7(DN1) USB1.B7(DN2)
UART_P: U11.1(UD+) USB1.A6(DP1) USB1.B6(DP2)
USB-OTG1_N: D6.2 D6.9 USB2.2(D-) ; port USB-OTG1_N
USB-OTG1_P: D6.4 D6.7 USB2.3(D+) ; port USB-OTG1_P
NetC50_1: C50.1 U12.20(CPOUT)
NetC53_1: C53.1 U12.10(REGOUT)
NetD6_5: D6.5 D6.6 R38.2 USB2.4(ID) ; port USB-OTG1_ID
NetJ6_1: J6.1 U11.9(RXD) ; port UART0-TX
NetJ6_2: J6.2 U11.8(TXD) ; port UART0-RX
NetR36_2: R36.2 USB1.B5(CC2)
NetR37_2: R37.2 USB1.A5(CC1)

Not connected (* = marked no-connect by the designer): U11 4(RTS#)* 5(CTS#)* 6(TNOW)*; U12 1(CLKIN)* 2(NC) 3(NC) 4(NC) 5(NC) 6(AUX_DA) 7(AUX_CL) 11(FSYNC)* 12(INT) 14(NC) 15(NC) 16(NC) 17(NC) 19(RESV) 21(RESV) 22(RESV); USB1 A8(SBU1) B8(SBU2)

### Layout directives
differential pair; differential pair class DIFF90_USB: UART_N, UART_P

### Notes on the sheet
- (near U12) 0x68

### Library data of the parts
C46 C49 = 0603X106M160CT: as C1 on sheet POwer; Package / Case: 0402; Component type: Capacitor; Manufacture part: 0603X106M160CT; Capacitor value: 10uF; Voltage: 16V; Package: 0603
C47 C48 C51-C53 = 0402X104K250CT: as C10 on sheet CPU; Package / Case: 0402; Component type: Capacitor; Manufacture part: 0402X104K250CT; Capacitor value: 100nF; Voltage: 25V; Package: 0402
C50 = 0402B222K500CT: 50V 2.2nF X7R ±10% 0402 Multilayer Ceramic Capacitors MLCC - SMD/SMT ROHS; Manufacture: WALSIN; Package / Case: 0402; Component type: Capacitor; Manufacture part: 0402B222K500CT; Capacitor value: 2.2nF; Voltage: 50V; Package: 0402
D6 = ESD0524P: DFN2510 ESD Protection Devices ROHS; Manufacture: MDD（Microdiode Electronics）; Type: TVS/ESD Bi diode; Diode value: 5V; Manufacture part: ESD0524P; Package: DFN2510; Datasheet: https://datasheet.lcsc.com/lcsc/2009281808_MDD-Microdiode-Electronics--ESD0524P_C840786.pdf
J4 J5 = 1.25T-4P-WT: MX1.25 Header Male Pin 0.049"(1.25mm) 4 SMD,P=1.25mm Wire To Board / Wire To Wire Connector RoHS; Manufacture: Korean Hroparts Elec; Manufacture part: 1.25T-4P-WT; Type: MX1.25; Datasheet: https://datasheet.lcsc.com/lcsc/1903211730_Korean-Hroparts-Elec-1-25T-4P-WT_C125739.pdf
J6 = PZ254V-11-03P: Pin Header 3 1 Straight，180degrees 2.54mm Through Hole,P=2.54mm Pin Header & Female Header RoHS; Manufacture: XFCN; Manufacture part: PZ254V-11-03P; Type: Pin Header; Datasheet: https://datasheet.lcsc.com/lcsc/2003141409_XFCN-PZ254V-11-02P_C492401.pdf
R36 R37 = WR04X5101FTL: 5.1kΩ ±1% 1/16W ±100ppm/℃ 0402 Chip Resistor - Surface Mount RoHS; Manufacture: WALSIN; Package / Case: 0201; Component type: Resistor; Manufacture part: WR04X5101FTL; Resistor value: 5.1K; Package: 0402
R38 = WR04X1002FTL: as R3 on sheet POwer; Package / Case: 0201; Component type: Resistor; Manufacture part: WR04X1002FTL; Resistor value: 10K; Package: 0402
U11 = CH340E: Transceiver USB 2.0 2Mbps MSOP-10 USB ICs RoHS; Manufacture: WCH; Manufacture part: CH340E; Package: MSOP-10; Datasheet: https://datasheet.lcsc.com/lcsc/2008191806_WCH-Jiangsu-Qin-Heng-CH340E_C99652.pdf
U12 = MPU-6050: 6-axis accelerometer/gyroscope; Manufacture: TDK InvenSense; Manufacture part: MPU-6050; Package: QFN-24 (4x4); Datasheet: https://datasheet.lcsc.com/lcsc/1811071024_TDK-InvenSense-MPU-6050_C24112.pdf
USB1 = 918-418K2023S40001: USB - Type C Female 16 SMD USB Connectors RoHS; Manufacture: Jing Extension of the Electronic Co.; Manufacture part: 918-418K2023S40001; Type: USB-C; Datasheet: https://datasheet.lcsc.com/lcsc/2103051833_Jing-Extension-of-the-Electronic-Co-918-418K2023S40001_C167321.pdf
USB2 = 920-E52A2021S10100: USB - Micro B Female USB 2 USB Connectors RoHS; Manufacture: Jing Extension of the Electronic Co.; Manufacture part: 920-E52A2021S10100; Type: USB-Micro B; Datasheet: https://datasheet.lcsc.com/lcsc/2103051832_Jing-Extension-of-the-Electronic-Co-920-E52A2021S10100_C10418.pdf

## Nets that join several sheets
AVCC: POwer (C8.2 R8.2 TP4.1 U4.5), Audio (C35.2 U5.80)
GND: POwer (17 pins), CPU (20 pins), LCD (23 pins), Memory (10 pins), Audio (13 pins), Misc (25 pins)
UVCC: POwer (C2.2 L1.2 R1.2 TP1.1), CPU (13 pins), LCD (6 pins), Memory (21 pins), Audio (FB1.1), Misc (8 pins)
V-BACKLIGHT: POwer (13 pins), LCD (C27.2 C28.2 L4.1 U6.2), Misc (9 pins)
VCC-DRAM: POwer (C4.2 L2.2 R4.2 TP2.1), CPU (12 pins)
VDD-CORE: POwer (C6.2 L3.2 R6.2 TP3.1), CPU (6 pins)
LED1: CPU (R13.2 U5.42), Misc (J5.3)
LED2: CPU (R14.2 U5.41), Misc (J5.2)
NetD5_2: CPU (U5.43), LCD (D5.2)
NetD6_5: CPU (U5.40), Misc (D6.5 D6.6 R38.2 USB2.4)
NetJ1_1: CPU (U5.39), LCD (J1.1)
NetJ1_4: CPU (U5.44), LCD (J1.4 U7.7)
NetJ2_31: CPU (U5.45), LCD (J2.31 U6.1)
NetJ6_1: CPU (U5.48), Misc (J6.1 U11.9)
NetJ6_2: CPU (U5.49), Misc (J6.2 U11.8)
NetR24_1: CPU (U5.47), Memory (R24.1 S1.9)
NetR27_2: CPU (U5.60), Memory (R27.2 U8.1)
NetR30_1: CPU (U5.65), Memory (R30.1 U9.20)
NetSW2_2: CPU (U5.59), Memory (SW2.2 U8.7)
NetU5_46: CPU (U5.46), Memory (U9.21)
NetU5_61: CPU (U5.61), Memory (U8.2)
NetU5_62: CPU (U5.62), Memory (U8.8)
NetU5_63: CPU (U5.63), Memory (U9.17)
NetU5_64: CPU (U5.64), Memory (U9.22)
NetU5_66: CPU (U5.66), Memory (U9.18)
SS-SCL: CPU (R15.1 U5.38), LCD (J1.6 U7.9), Misc (J4.2 U12.23)
SS-SDA: CPU (R16.1 U5.37), LCD (J1.5 U7.10), Misc (J4.3 U12.24)
USB-OTG1_N: CPU (U5.68), Misc (D6.2 D6.9 USB2.2)
USB-OTG1_P: CPU (U5.69), Misc (D6.4 D6.7 USB2.3)